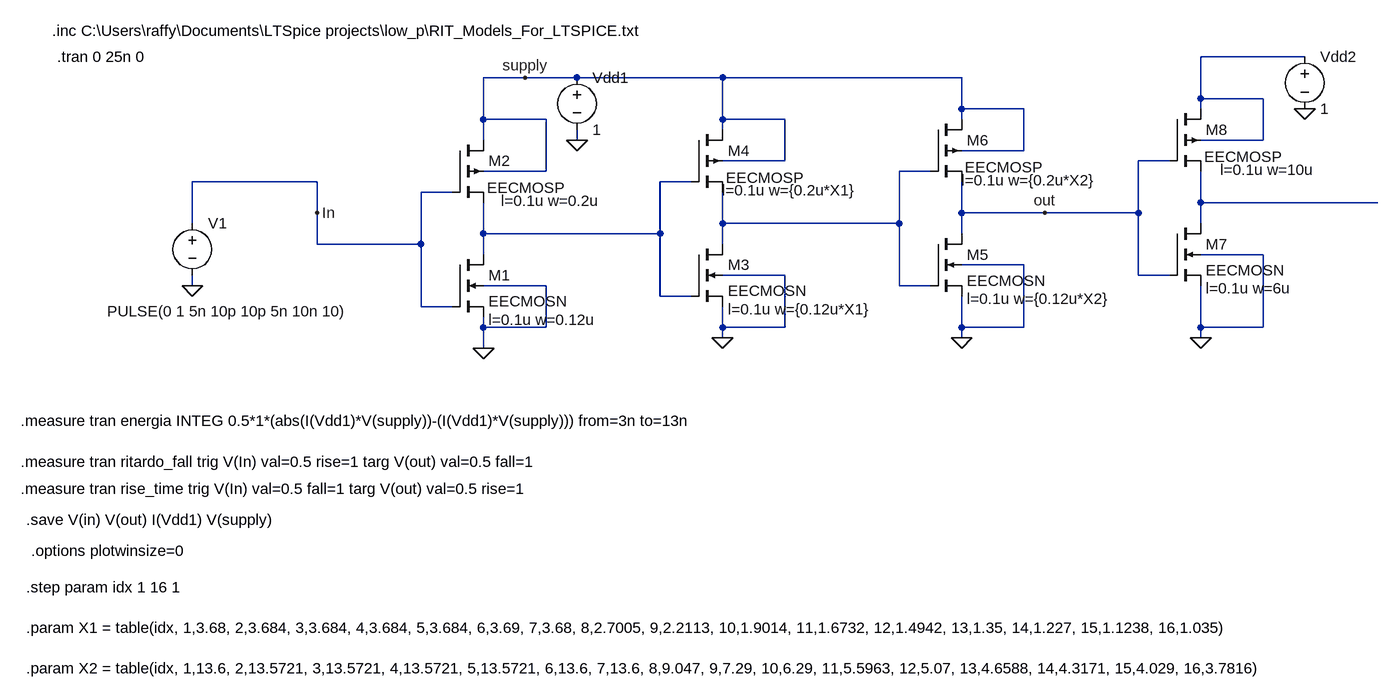
[diagram p0: schematic final_buff_test.asc]
final_buff_test.asc, the LTspice schematic file:
Version 4
SHEET 1 1640 760
WIRE 1488 -192 1328 -192
WIRE 288 -160 224 -160
WIRE 368 -160 288 -160
WIRE 592 -160 368 -160
WIRE 960 -160 592 -160
WIRE 1328 -128 1328 -192
WIRE 1424 -128 1328 -128
WIRE 960 -112 960 -160
WIRE 1056 -112 960 -112
WIRE 1328 -112 1328 -128
WIRE 224 -96 224 -160
WIRE 320 -96 224 -96
WIRE 592 -96 592 -160
WIRE 688 -96 592 -96
WIRE 960 -96 960 -112
WIRE 592 -80 592 -96
WIRE 224 -64 224 -96
WIRE 368 -64 368 -80
WIRE 1424 -64 1424 -128
WIRE 1424 -64 1328 -64
WIRE 1056 -48 1056 -112
WIRE 1056 -48 960 -48
WIRE 688 -32 688 -96
WIRE 688 -32 592 -32
WIRE 1280 -32 1232 -32
WIRE 320 -16 320 -96
WIRE 320 -16 224 -16
WIRE 912 -16 864 -16
WIRE -32 0 -224 0
WIRE 544 0 496 0
WIRE 176 16 128 16
WIRE 1328 32 1328 -16
WIRE 1600 32 1328 32
WIRE -32 48 -32 0
WIRE 960 48 960 0
WIRE 1088 48 960 48
WIRE 1232 48 1232 -32
WIRE 1232 48 1088 48
WIRE -224 64 -224 0
WIRE 592 64 592 16
WIRE 864 64 864 -16
WIRE 864 64 592 64
WIRE 1328 64 1328 32
WIRE 224 80 224 32
WIRE 496 80 496 0
WIRE 496 80 224 80
WIRE 960 80 960 48
WIRE -32 96 -32 48
WIRE 128 96 128 16
WIRE 128 96 -32 96
WIRE 592 96 592 64
WIRE 224 112 224 80
WIRE 1424 112 1328 112
WIRE 1056 128 960 128
WIRE 688 144 592 144
WIRE 1232 144 1232 48
WIRE 1280 144 1232 144
WIRE -224 160 -224 144
WIRE 320 160 224 160
WIRE 864 160 864 64
WIRE 912 160 864 160
WIRE 496 176 496 80
WIRE 544 176 496 176
WIRE 128 192 128 96
WIRE 176 192 128 192
WIRE 224 224 224 208
WIRE 320 224 320 160
WIRE 320 224 224 224
WIRE 592 224 592 192
WIRE 688 224 688 144
WIRE 688 224 592 224
WIRE 960 224 960 176
WIRE 1056 224 1056 128
WIRE 1056 224 960 224
WIRE 1328 224 1328 160
WIRE 1424 224 1424 112
WIRE 1424 224 1328 224
WIRE 592 240 592 224
WIRE 960 240 960 224
WIRE 1328 240 1328 224
WIRE 224 256 224 224
FLAG 224 256 0
FLAG -224 160 0
FLAG 368 -64 0
FLAG 288 -160 supply
FLAG -32 48 In
FLAG 592 240 0
FLAG 1488 -112 0
FLAG 1088 48 out
FLAG 960 240 0
FLAG 1328 240 0
SYMBOL nmos4 176 112 R0
WINDOW 123 56 100 Left 2
SYMATTR Value2 l=0.1u w=0.12u
SYMATTR InstName M1
SYMATTR Value EECMOSN
SYMBOL pmos4 176 -64 R0
WINDOW 3 113 58 Top 2
WINDOW 123 151 109 Bottom 2
SYMATTR Value EECMOSP
SYMATTR Value2 l=0.1u w=0.2u
SYMATTR InstName M2
SYMBOL voltage 368 -176 R0
WINDOW 123 0 0 Left 0
WINDOW 39 0 0 Left 0
SYMATTR InstName Vdd1
SYMATTR Value 1
SYMBOL voltage -224 48 R0
WINDOW 3 -131 151 Left 2
WINDOW 123 0 0 Left 0
WINDOW 39 0 0 Left 0
SYMATTR Value PULSE(0 1 5n 10p 10p 5n 10n 10)
SYMATTR InstName V1
SYMBOL nmos4 544 96 R0
WINDOW 123 56 100 Left 2
SYMATTR Value2 l=0.1u w={0.12u*X1}
SYMATTR InstName M3
SYMATTR Value EECMOSN
SYMBOL pmos4 544 -80 R0
WINDOW 3 113 58 Top 2
WINDOW 123 151 109 Bottom 2
SYMATTR Value EECMOSP
SYMATTR Value2 l=0.1u w={0.2u*X1}
SYMATTR InstName M4
SYMBOL nmos4 912 80 R0
WINDOW 123 56 100 Left 2
SYMATTR Value2 l=0.1u w={0.12u*X2}
SYMATTR InstName M5
SYMATTR Value EECMOSN
SYMBOL pmos4 912 -96 R0
WINDOW 3 113 58 Top 2
WINDOW 123 151 109 Bottom 2
SYMATTR Value EECMOSP
SYMATTR Value2 l=0.1u w={0.2u*X2}
SYMATTR InstName M6
SYMBOL nmos4 1280 64 R0
WINDOW 123 56 100 Left 2
SYMATTR Value2 l=0.1u w=6u
SYMATTR InstName M7
SYMATTR Value EECMOSN
SYMBOL pmos4 1280 -112 R0
WINDOW 3 113 58 Top 2
WINDOW 123 151 109 Bottom 2
SYMATTR Value EECMOSP
SYMATTR Value2 l=0.1u w=10u
SYMATTR InstName M8
SYMBOL voltage 1488 -208 R0
WINDOW 123 0 0 Left 0
WINDOW 39 0 0 Left 0
SYMATTR InstName Vdd2
SYMATTR Value 1
TEXT -440 -232 Left 2 !.inc C:\\Users\\raffy\\Documents\\LTSpice projects\\low_p\\RIT_Models_For_LTSPICE.txt
TEXT -432 -192 Left 2 !.tran 0 25n 0
TEXT -488 368 Left 2 !.measure tran energia INTEG 0.5*1*(abs(I(Vdd1)*V(supply))-(I(Vdd1)*V(supply))) from=3n to=13n\n \n.measure tran ritardo_fall trig V(In) val=0.5 rise=1 targ V(out) val=0.5 fall=1
TEXT -488 472 Left 2 !.measure tran rise_time trig V(In) val=0.5 fall=1 targ V(out) val=0.5 rise=1
TEXT -480 520 Left 2 !.save V(in) V(out) I(Vdd1) V(supply)
TEXT -472 568 Left 2 !.options plotwinsize=0
TEXT -480 624 Left 2 !.step param idx 1 16 1\n \n.param X1 = table(idx, 1,3.68, 2,3.684, 3,3.684, 4,3.684, 5,3.684, 6,3.69, 7,3.68, 8,2.7005, 9,2.2113, 10,1.9014, 11,1.6732, 12,1.4942, 13,1.35, 14,1.227, 15,1.1238, 16,1.035)\n \n.param X2 = table(idx, 1,13.6, 2,13.5721, 3,13.5721, 4,13.5721, 5,13.5721, 6,13.6, 7,13.6, 8,9.047, 9,7.29, 10,6.29, 11,5.5963, 12,5.07, 13,4.6588, 14,4.3171, 15,4.029, 16,3.7816)

The netlist it stands for:
* final_buff_test.asc
M1 N003 In 0 0 EECMOSN l=0.1u w=0.12u
M2 supply In N003 supply EECMOSP l=0.1u w=0.2u
Vdd1 supply 0 1
V1 In 0 PULSE(0 1 5n 10p 10p 5n 10n 10)
M3 N002 N003 0 0 EECMOSN l=0.1u w={0.12u*X1}
M4 supply N003 N002 supply EECMOSP l=0.1u w={0.2u*X1}
M5 out N002 0 0 EECMOSN l=0.1u w={0.12u*X2}
M6 supply N002 out supply EECMOSP l=0.1u w={0.2u*X2}
M7 N004 out 0 0 EECMOSN l=0.1u w=6u
M8 N001 out N004 N001 EECMOSP l=0.1u w=10u
Vdd2 N001 0 1
.model NMOS NMOS
.model PMOS PMOS
.lib standard.mos
.inc C:\Users\raffy\Documents\LTSpice projects\low_p\RIT_Models_For_LTSPICE.txt
.tran 0 25n 0
.measure tran energia INTEG 0.5*1*(abs(I(Vdd1)*V(supply))-(I(Vdd1)*V(supply))) from=3n to=13n
.measure tran ritardo_fall trig V(In) val=0.5 rise=1 targ V(out) val=0.5 fall=1
.measure tran rise_time trig V(In) val=0.5 fall=1 targ V(out) val=0.5 rise=1
.save V(in) V(out) I(Vdd1) V(supply)
.options plotwinsize=0
.step param idx 1 16 1
.param X1 = table(idx, 1,3.68, 2,3.684, 3,3.684, 4,3.684, 5,3.684, 6,3.69, 7,3.68, 8,2.7005, 9,2.2113, 10,1.9014, 11,1.6732, 12,1.4942, 13,1.35, 14,1.227, 15,1.1238, 16,1.035)
.param X2 = table(idx, 1,13.6, 2,13.5721, 3,13.5721, 4,13.5721, 5,13.5721, 6,13.6, 7,13.6, 8,9.047, 9,7.29, 10,6.29, 11,5.5963, 12,5.07, 13,4.6588, 14,4.3171, 15,4.029, 16,3.7816)
.backanno
.end